# Altium schematic sheet valve.SchDoc: Monolith Valve Drivers
size A; SheetNumber: 4; SheetTotal: 5; R_OVR: 10k
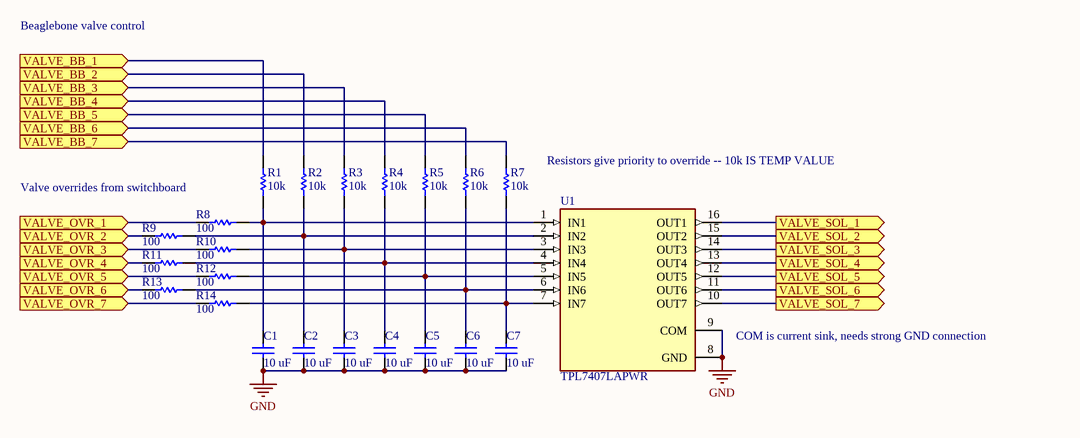
[diagram p0: valve.SchDoc]

## Parts
C1  10 uF  [C0805]
C2  10 uF  [C0805]
C3  10 uF  [C0805]
C4  10 uF  [C0805]
C5  10 uF  [C0805]
C6  10 uF  [C0805]
C7  10 uF  [C0805]
R1  10k  [R0603]
R2  10k  [R0603]
R3  10k  [R0603]
R4  10k  [R0603]
R5  10k  [R0603]
R6  10k  [R0603]
R7  10k  [R0603]
R8  100  [R0603]
R9  100  [R0603]
R10  100  [R0603]
R11  100  [R0603]
R12  100  [R0603]
R13  100  [R0603]
R14  100  [R0603]
U1  TPL7407LAPWR  [FP-PW0016A-IPC_A]

## Ports
VALVE_BB_1 (in), VALVE_BB_2 (in), VALVE_BB_3 (in), VALVE_BB_4 (in), VALVE_BB_5 (in), VALVE_BB_6 (in), VALVE_BB_7 (in), VALVE_OVR_1 (in), VALVE_OVR_2 (in), VALVE_OVR_3 (in), VALVE_OVR_4 (in), VALVE_OVR_5 (in), VALVE_OVR_6 (in), VALVE_OVR_7 (in), VALVE_SOL_1 (out), VALVE_SOL_2 (out), VALVE_SOL_3 (out), VALVE_SOL_4 (out), VALVE_SOL_5 (out), VALVE_SOL_6 (out), VALVE_SOL_7 (out)

## Nets
GND: C1.2 C2.2 C3.2 C4.2 C5.2 C6.2 C7.2 U1.8(GND) U1.9(COM)
VALVE_BB_1: R1.1 ; port VALVE_BB_1
VALVE_BB_2: R2.1 ; port VALVE_BB_2
VALVE_BB_3: R3.1 ; port VALVE_BB_3
VALVE_BB_4: R4.1 ; port VALVE_BB_4
VALVE_BB_5: R5.1 ; port VALVE_BB_5
VALVE_BB_6: R6.1 ; port VALVE_BB_6
VALVE_BB_7: R7.1 ; port VALVE_BB_7
VALVE_OVR_1: R8.2 ; port VALVE_OVR_1
VALVE_OVR_2: R9.2 ; port VALVE_OVR_2
VALVE_OVR_3: R10.2 ; port VALVE_OVR_3
VALVE_OVR_4: R11.2 ; port VALVE_OVR_4
VALVE_OVR_5: R12.2 ; port VALVE_OVR_5
VALVE_OVR_6: R13.2 ; port VALVE_OVR_6
VALVE_OVR_7: R14.2 ; port VALVE_OVR_7
VALVE_SOL_1: U1.16(OUT1) ; port VALVE_SOL_1
VALVE_SOL_2: U1.15(OUT2) ; port VALVE_SOL_2
VALVE_SOL_3: U1.14(OUT3) ; port VALVE_SOL_3
VALVE_SOL_4: U1.13(OUT4) ; port VALVE_SOL_4
VALVE_SOL_5: U1.12(OUT5) ; port VALVE_SOL_5
VALVE_SOL_6: U1.11(OUT6) ; port VALVE_SOL_6
VALVE_SOL_7: U1.10(OUT7) ; port VALVE_SOL_7
NetC1_1: C1.1 R1.2 R8.1 U1.1(IN1)
NetC2_1: C2.1 R2.2 R9.1 U1.2(IN2)
NetC3_1: C3.1 R3.2 R10.1 U1.3(IN3)
NetC4_1: C4.1 R4.2 R11.1 U1.4(IN4)
NetC5_1: C5.1 R5.2 R12.1 U1.5(IN5)
NetC6_1: C6.1 R6.2 R13.1 U1.6(IN6)
NetC7_1: C7.1 R7.2 R14.1 U1.7(IN7)

## Notes on the sheet
- Beaglebone valve control
- Valve overrides from switchboard
- Resistors give priority to override -- 10k IS TEMP VALUE
- (near U1) COM is current sink, needs strong GND connection

## Library data of the parts
C1-C7 = C0805: 0805 Capacitor; Value: 10 uF
R1-R14 = R0603: RESISTOR 0603
  R1-R7: Value: 10k
  R8-R14: Value: 100
U1 = CMP-04910-000066-1: IC PWR DRIVER N-CHAN 1:1 16TSSOP; Interface: Parallel; Output Configuration: Low Side; Number of Outputs: 7; Max Output Current: 500mA; Case/Package: TSSOP; Packaging: Cut Tape; RoHS Compliant: Yes; Max Operating Temperature: 125°C; Min Operating Temperature: -40°C; Number of Drivers: 7; Number of Pins: 16